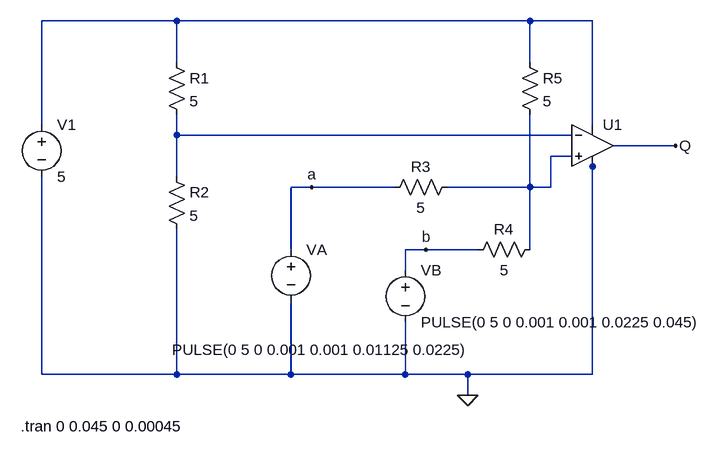
[diagram p0: schematic exercise3.asc]
exercise3.asc, the LTspice schematic file:
Version 4
SHEET 1 880 680
WIRE -16 -16 -224 -16
WIRE 528 -16 -16 -16
WIRE 624 -16 528 -16
WIRE -16 48 -16 -16
WIRE 528 48 528 -16
WIRE -224 144 -224 -16
WIRE 624 144 624 -16
WIRE -16 160 -16 128
WIRE 592 160 -16 160
WIRE 752 176 656 176
WIRE 592 192 560 192
WIRE 624 208 624 192
WIRE -16 224 -16 160
WIRE 192 240 160 240
WIRE 320 240 192 240
WIRE 528 240 528 128
WIRE 528 240 400 240
WIRE 560 240 560 192
WIRE 560 240 528 240
WIRE 160 336 160 240
WIRE 368 336 336 336
WIRE 448 336 368 336
WIRE 528 336 528 240
WIRE 336 368 336 336
WIRE -224 528 -224 224
WIRE -16 528 -16 304
WIRE -16 528 -224 528
WIRE 160 528 160 416
WIRE 160 528 -16 528
WIRE 336 528 336 448
WIRE 336 528 160 528
WIRE 432 528 336 528
WIRE 624 528 624 208
WIRE 624 528 432 528
WIRE 432 560 432 528
FLAG 752 176 Q
FLAG 192 240 a
FLAG 368 336 b
FLAG 432 560 0
SYMBOL voltage -224 128 R0
WINDOW 123 0 0 Left 0
WINDOW 39 0 0 Left 0
SYMATTR InstName V1
SYMATTR Value 5
SYMBOL res -32 32 R0
SYMATTR InstName R1
SYMATTR Value 5
SYMBOL res -32 208 R0
SYMATTR InstName R2
SYMATTR Value 5
SYMBOL res 512 32 R0
SYMATTR InstName R5
SYMATTR Value 5
SYMBOL res 416 224 R90
WINDOW 0 0 56 VBottom 2
WINDOW 3 32 56 VTop 2
SYMATTR InstName R3
SYMATTR Value 5
SYMBOL res 544 320 R90
WINDOW 0 0 56 VBottom 2
WINDOW 3 32 56 VTop 2
SYMATTR InstName R4
SYMATTR Value 5
SYMBOL OpAmps\\UniversalOpAmp2 624 176 R0
SYMATTR InstName U1
SYMBOL voltage 160 320 R0
WINDOW 3 -183 170 Left 2
WINDOW 123 0 0 Left 0
WINDOW 39 0 0 Left 0
SYMATTR Value PULSE(0 5 0 0.001 0.001 0.01125 0.0225)
SYMATTR InstName VA
SYMBOL voltage 336 352 R0
WINDOW 123 0 0 Left 0
WINDOW 39 0 0 Left 0
SYMATTR InstName VB
SYMATTR Value PULSE(0 5 0 0.001 0.001 0.0225 0.045)
TEXT -256 608 Left 2 !.tran 0 0.045 0 0.00045

The netlist it stands for:
* exercise3.asc
V1 N001 0 5
R1 N001 N002 5
R2 N002 0 5
R5 N001 N003 5
R3 N003 a 5
R4 N003 b 5
XU1 N003 N002 N001 0 Q level2 Avol=1Meg GBW=10Meg Slew=10Meg Ilimit=25m Rail=0 Vos=0 En=0 Enk=0 In=0 Ink=0 Rin=500Meg  ; pins In+ In- V+ V- OUT
VA a 0 PULSE(0 5 0 0.001 0.001 0.01125 0.0225)
VB b 0 PULSE(0 5 0 0.001 0.001 0.0225 0.045)
.tran 0 0.045 0 0.00045
.lib UniversalOpAmp2.lib
.backanno
.end